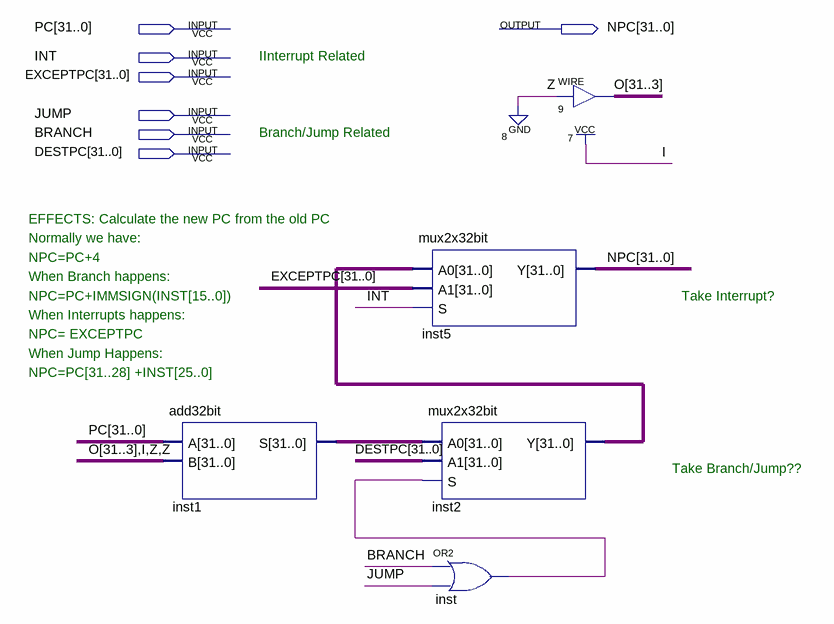
[diagram p0: schematic sheet]
// Quartus schematic PROCESSPC.bdf as structural Verilog: 5 symbols, 7 pins
module PROCESSPC (
  input  [31:0] PC,
  input  INT,
  input  [31:0] EXCEPTPC,
  input  JUMP,
  input  BRANCH,
  input  [31:0] DESTPC,
  output [31:0] NPC
);

  wire inst_out;
  wire [31:0] inst1_s, inst2_y;
  wire [31:3] O;

  add32bit inst1 (.A(PC), .B({O, 3'b100}), .S(inst1_s));
  mux2x32bit inst5 (.A0(inst2_y), .A1(EXCEPTPC), .S(INT), .Y(NPC));
  mux2x32bit inst2 (.A0(inst1_s), .A1(DESTPC), .S(inst_out), .Y(inst2_y));
  or inst (inst_out, BRANCH, JUMP);
  assign O = {29{1'b0}};  // WIRE 9

  // Notes on the sheet:
  //   IInterrupt Related
  //   Branch/Jump Related
  //   EFFECTS: Calculate the new PC from the old PC
  //   Normally we have:
  //   NPC=PC+4
  //   When Branch happens:
  //   NPC=PC+IMMSIGN(INST[15..0])
  //   Take Interrupt?
  //   When Interrupts happens:
  //   NPC= EXCEPTPC
  //   When Jump Happens:
  //   NPC=PC[31..28] +INST[25..0]
  //   Take Branch/Jump??
endmodule
